# EAGLE design pi-crust14 (EAGLE 6.5.0)
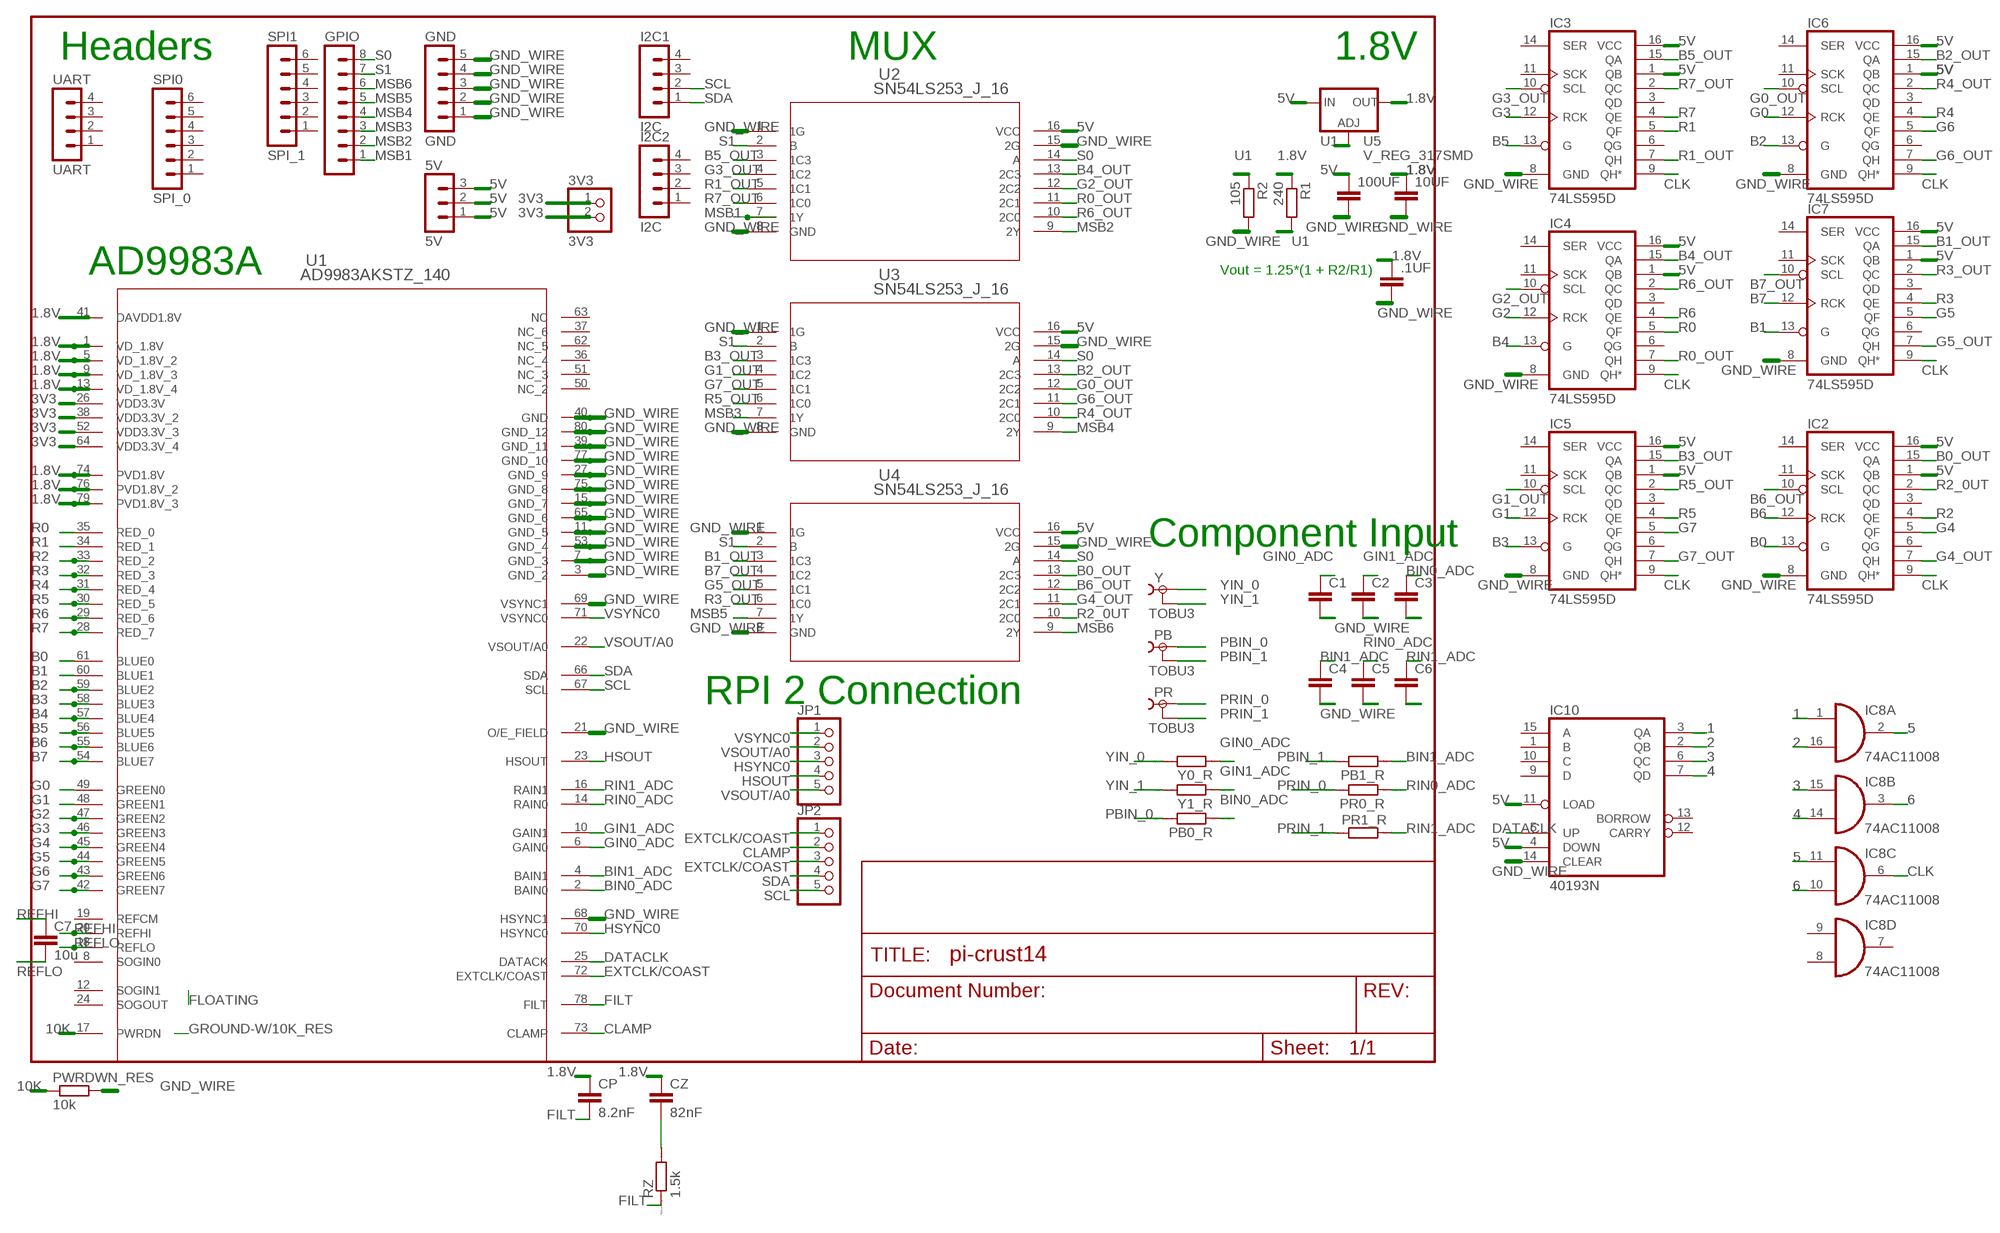
[diagram p0: schematic, sheet 1]

## Parts
3V3  3V3  PINHD-1X2  [1X02]
5V  5V  MA03-1  [MA03-1]
10UF  C2.5/5  [C2.5-5]
100UF  C2.5/5  [C2.5-5]
.1UF  C2.5/5  [C2.5-5]
C1  C2.5/5  [C2.5-5]
C2  C2.5/5  [C2.5-5]
C3  C2.5/5  [C2.5-5]
C4  C2.5/5  [C2.5-5]
C5  C2.5/5  [C2.5-5]
C6  C2.5/5  [C2.5-5]
C7  10u  C2.5/5  [C2.5-5]
CP  8.2nF  C2.5/5  [C2.5-5]
CZ  82nF  C2.5/5  [C2.5-5]
GND  GND  MA05-1  [MA05-1]
GPIO  MA08-1  [MA08-1]
I2C1  I2C  MA04-1  [MA04-1]
I2C2  I2C  MA04-1  [MA04-1]
IC2  74LS595D  [SO16]
IC3  74LS595D  [SO16]
IC4  74LS595D  [SO16]
IC5  74LS595D  [SO16]
IC6  74LS595D  [SO16]
IC7  74LS595D  [SO16]
IC8  74AC11008  [DIL16]
IC10  40193N  [DIL16]
JP1  PINHD-1X5  [1X05]
JP2  PINHD-1X5  [1X05]
PB  TOBU3  [TOBU3]
PB0_R  R0204/7  [0204/7]
PB1_R  R0204/7  [0204/7]
PR  TOBU3  [TOBU3]
PR0_R  R0204/7  [0204/7]
PR1_R  R0204/7  [0204/7]
PWRDWN_RES  10k  R-EU_0204/7  [0204/7]
R1  240  R-EU_0204/7  [0204/7]
R2  105  R-EU_0204/7  [0204/7]
RZ  1.5k  R0204/7  [0204/7]
SPI0  SPI_0  MA06-1  [MA06-1]
SPI1  SPI_1  MA06-1  [MA06-1]
U1  AD9983AKSTZ_140  [ST_80_2]
U2  SN54LS253_J_16  [J16]
U3  SN54LS253_J_16  [J16]
U4  SN54LS253_J_16  [J16]
U5  V_REG_317SMD  [SOT223]
UART  UART  MA04-1  [MA04-1]
Y  TOBU3  [TOBU3]
Y0_R  R0204/7  [0204/7]
Y1_R  R0204/7  [0204/7]

## Nets
1: IC8.1(A:I0) IC10.3(QA)
1.8V: 10UF.1 .1UF.1 CP.1 CZ.1 R1.1 U1.1(VD_1.8V) U1.5(VD_1.8V_2) U1.9(VD_1.8V_3) U1.13(VD_1.8V_4) U1.41(DAVDD1.8V) U1.74(PVD1.8V) U1.76(PVD1.8V_2) U1.79(PVD1.8V_3) U5.2(OUT)
2: IC8.16(A:I1) IC10.2(QB)
3: IC8.15(B:I0) IC10.6(QC)
3V3: 3V3.1 3V3.2 U1.26(VDD3.3V) U1.38(VDD3.3V_2) U1.52(VDD3.3V_3) U1.64(VDD3.3V_4)
4: IC8.14(B:I1) IC10.7(QD)
5: IC8.2(A:O) IC8.11(C:I0)
5V: 5V.1 5V.2 5V.3 100UF.1 IC2.1(QB) IC2.16(VCC) IC3.1(QB) IC3.16(VCC) IC4.1(QB) IC4.16(VCC) IC5.1(QB) IC5.16(VCC) IC6.1(QB) IC6.16(VCC) IC7.1(QB) IC7.16(VCC) IC10.4(DOWN) IC10.11(LOAD) U2.16(VCC) U3.16(VCC) U4.16(VCC) U5.3(IN)
6: IC8.3(B:O) IC8.10(C:I1)
10K: PWRDWN_RES.1 U1.17(PWRDN)
B0: IC2.13(G) U1.61(BLUE0)
B0_OUT: IC2.15(QA) U4.13(2C3)
B1: IC7.13(G) U1.60(BLUE1)
B1_OUT: IC7.15(QA) U4.3(1C3)
B2: IC6.13(G) U1.59(BLUE2)
B2_OUT: IC6.15(QA) U3.13(2C3)
B3: IC5.13(G) U1.58(BLUE3)
B3_OUT: IC5.15(QA) U3.3(1C3)
B4: IC4.13(G) U1.57(BLUE4)
B4_OUT: IC4.15(QA) U2.13(2C3)
B5: IC3.13(G) U1.56(BLUE5)
B5_OUT: IC3.15(QA) U2.3(1C3)
B6: IC2.12(RCK) U1.55(BLUE6)
B6_OUT: IC2.10(SCL) U4.12(2C2)
B7: IC7.12(RCK) U1.54(BLUE7)
B7_OUT: IC7.10(SCL) U4.4(1C2)
BIN0_ADC: C3.1 PB0_R.1 U1.2(BAIN0)
BIN1_ADC: C4.1 PB1_R.1 U1.4(BAIN1)
CLAMP: JP2.2 U1.73(CLAMP)
CLK: IC2.9(QH*) IC3.9(QH*) IC4.9(QH*) IC5.9(QH*) IC6.9(QH*) IC7.9(QH*) IC8.6(C:O)
DATACLK: IC10.5(UP) U1.25(DATACK)
EXTCLK/COAST: JP2.1 JP2.3 U1.72(EXTCLK/COAST)
FILT: CP.2 RZ.1 U1.78(FILT)
G0: IC6.12(RCK) U1.49(GREEN0)
G0_OUT: IC6.10(SCL) U3.12(2C2)
G1: IC5.12(RCK) U1.48(GREEN1)
G1_OUT: IC5.10(SCL) U3.4(1C2)
G2: IC4.12(RCK) U1.47(GREEN2)
G2_OUT: IC4.10(SCL) U2.12(2C2)
G3: IC3.12(RCK) U1.46(GREEN3)
G3_OUT: IC3.10(SCL) U2.4(1C2)
G4: IC2.5(QF) U1.45(GREEN4)
G4_OUT: IC2.7(QH) U4.11(2C1)
G5: IC7.5(QF) U1.44(GREEN5)
G5_OUT: IC7.7(QH) U4.5(1C1)
G6: IC6.5(QF) U1.43(GREEN6)
G6_OUT: IC6.7(QH) U3.11(2C1)
G7: IC5.5(QF) U1.42(GREEN7)
G7_OUT: IC5.7(QH) U3.5(1C1)
GIN0_ADC: C1.1 U1.6(GAIN0) Y0_R.1
GIN1_ADC: C2.1 U1.10(GAIN1) Y1_R.1
GND_WIRE: 10UF.2 100UF.2 .1UF.2 C1.2 C2.2 C3.2 C4.2 C5.2 C6.2 GND.1 GND.2 GND.3 GND.4 GND.5 IC2.8(GND) IC3.8(GND) IC4.8(GND) IC5.8(GND) IC6.8(GND) IC7.8(GND) IC10.14(CLEAR) PWRDWN_RES.2 R2.2 U1.3(GND_2) U1.7(GND_3) U1.11(GND_5) U1.15(GND_7) U1.21(O/E_FIELD) U1.27(GND_9) U1.39(GND_11) U1.40(GND) U1.53(GND_4) U1.65(GND_6) U1.68(HSYNC1) U1.69(VSYNC1) U1.75(GND_8) U1.77(GND_10) U1.80(GND_12) U2.1(1G) U2.8(GND) U2.15(2G) U3.1(1G) U3.8(GND) U3.15(2G) U4.1(1G) U4.8(GND) U4.15(2G)
HSOUT: JP1.4 U1.23(HSOUT)
HSYNC0: JP1.3 U1.70(HSYNC0)
MSB1: GPIO.1 U2.7(1Y)
MSB2: GPIO.2 U2.9(2Y)
MSB3: GPIO.3 U3.7(1Y)
MSB4: GPIO.4 U3.9(2Y)
MSB5: GPIO.5 U4.7(1Y)
MSB6: GPIO.6 U4.9(2Y)
N$1: CZ.2 RZ.2
PBIN_0: PB0_R.2 PB.1
PBIN_1: PB1_R.2 PB.2 PB.2@1 PB.2@2
PRIN_0: PR0_R.2 PR.1
PRIN_1: PR1_R.1 PR.2 PR.2@1 PR.2@2
R0: IC4.5(QF) U1.35(RED_0)
R0_OUT: IC4.7(QH) U2.11(2C1)
R1: IC3.5(QF) U1.34(RED_1)
R1_OUT: IC3.7(QH) U2.5(1C1)
R2: IC2.4(QE) U1.33(RED_2)
R2_0UT: IC2.2(QC) U4.10(2C0)
R3: IC7.4(QE) U1.32(RED_3)
R3_OUT: IC7.2(QC) U4.6(1C0)
R4: IC6.4(QE) U1.31(RED_4)
R4_OUT: IC6.2(QC) U3.10(2C0)
R5: IC5.4(QE) U1.30(RED_5)
R5_OUT: IC5.2(QC) U3.6(1C0)
R6: IC4.4(QE) U1.29(RED_6)
R6_OUT: IC4.2(QC) U2.10(2C0)
R7: IC3.4(QE) U1.28(RED_7)
R7_OUT: IC3.2(QC) U2.6(1C0)
REFHI: C7.1 U1.20(REFHI)
REFLO: C7.2 U1.18(REFLO)
RIN0_ADC: C5.1 PR0_R.1 U1.14(RAIN0)
RIN1_ADC: C6.1 PR1_R.2 U1.16(RAIN1)
S0: GPIO.8 U2.14(A) U3.14(A) U4.14(A)
S1: GPIO.7 U2.2(B) U3.2(B) U4.2(B)
SCL: I2C1.2 JP2.5 U1.67(SCL)
SDA: I2C1.1 JP2.4 U1.66(SDA)
U1: R1.2 R2.1 U5.1(ADJ)
VSOUT/A0: JP1.2 JP1.5 U1.22(VSOUT/A0)
VSYNC0: JP1.1 U1.71(VSYNC0)
YIN_0: Y0_R.2 Y.1
YIN_1: Y1_R.2 Y.2 Y.2@1 Y.2@2
Unconnected: I2C1.3 I2C1.4 I2C2.1 I2C2.2 I2C2.3 I2C2.4 IC2.3(QD) IC2.6(QG) IC2.11(SCK) IC2.14(SER) IC3.3(QD) IC3.6(QG) IC3.11(SCK) IC3.14(SER) IC4.3(QD) IC4.6(QG) IC4.11(SCK) IC4.14(SER) IC5.3(QD) IC5.6(QG) IC5.11(SCK) IC5.14(SER) IC6.3(QD) IC6.6(QG) IC6.11(SCK) IC6.14(SER) IC7.3(QD) IC7.6(QG) IC7.11(SCK) IC7.14(SER) IC8.7(D:O) IC8.8(D:I1) IC8.9(D:I0) IC10.1(B) IC10.9(D) IC10.10(C) IC10.12(CARRY) IC10.13(BORROW) IC10.15(A) SPI0.1 SPI0.2 SPI0.3 SPI0.4 SPI0.5 SPI0.6 SPI1.1 SPI1.2 SPI1.3 SPI1.4 SPI1.5 SPI1.6 U1.8(SOGIN0) U1.12(SOGIN1) U1.19(REFCM) U1.24(SOGOUT) U1.36(NC_4) U1.37(NC_6) U1.50(NC_2) U1.51(NC_3) U1.62(NC_5) U1.63(NC) UART.1 UART.2 UART.3 UART.4

## Notes on the sheet
- Headers | MUX | 1.8V
- AD9983A | Vout = 1.25*(1 + R2/R1)
- Component Input
- RPI 2 Connection

## Power pins joined to a net without a drawn wire
GND: IC8.4(P:GND) IC8.5(P:GND)
VCC: IC8.12(P:VCC) IC8.13(P:VCC)
VDD: IC10.16(VDD)
VSS: IC10.8(VSS)

## Library data of the parts
3V3 = pinhead:PINHD-1X2: PIN HEADER
5V = con-lstb:MA03-1: PIN HEADER; OC_FARNELL: unknown; OC_NEWARK: unknown
10UF 100UF .1UF C1-C7 CP CZ = capacitor-wima:C: CAPACITOR naming: grid - package width
GND = con-lstb:MA05-1: PIN HEADER; OC_FARNELL: unknown; OC_NEWARK: unknown
GPIO = con-lstb:MA08-1: PIN HEADER; OC_FARNELL: unknown; OC_NEWARK: unknown
I2C1 I2C2 UART = con-lstb:MA04-1: PIN HEADER; OC_FARNELL: unknown; OC_NEWARK: unknown
IC2-IC7 = SparkFun-DigitalIC:74*595: 8-bit SHIFT REGISTER, output latch; PROD_ID: IC-07875
IC8 = 74ac-logic:74AC11008: Quadruple 2-input AND
IC10 = 40xx:40193: Binary up down COUNTER
JP1 JP2 = pinhead:PINHD-1X5: PIN HEADER
PB PR Y = con-hirschmann:TOBU3: Female Cinch CONNECTOR ( RCA Jack ); MF: FARNELL; MPN: TOBU 3; OC_FARNELL: 592791; OC_NEWARK: 06WX5914
PB0_R PB1_R PR0_R PR1_R RZ Y0_R Y1_R = eagle-ltspice:R: RESISTOR, European symbol; SPICEMODEL: NONE; SPICEPREFIX: R
PWRDWN_RES R1 R2 = rcl:R-EU_: RESISTOR, European symbol
SPI0 SPI1 = con-lstb:MA06-1: PIN HEADER; OC_FARNELL: unknown; OC_NEWARK: unknown
U1 = ad9983a:AD9983AKSTZ_140
U2-U4 = MUX:SN54LS253_J_16; DATASHEETURL: http://www.ti.com/lit/gpn/SN54LS253; DESCRIPTION: Dual 4-Line To 1-Line Data Selectors/Multiplexers With 3-State Outputs; FAMILY_NAME: DATA SELECTOR/MULTIPLEXER; GENERIC_PART_NUMBER: SN54LS253; INDUSTRY_STD_PKG_TYPE: CDIP; MANUFACTURER: Texas Instruments; PACKAGE_DESIGNATOR: J; PIN_COUNT: 16
U5 = SparkFun-PowerIC:V_REG_317: Voltage Regulator Standard LM317 adjustable voltage regulator. AOI (Adjust Output Input). Google 'LM317 Calculator' for easy to use app to get the two resistor values needed. 240/720 for 5V output. 240/390 for 3.3V output. Spark Fun Electronics SKU : COM-00527

## Board
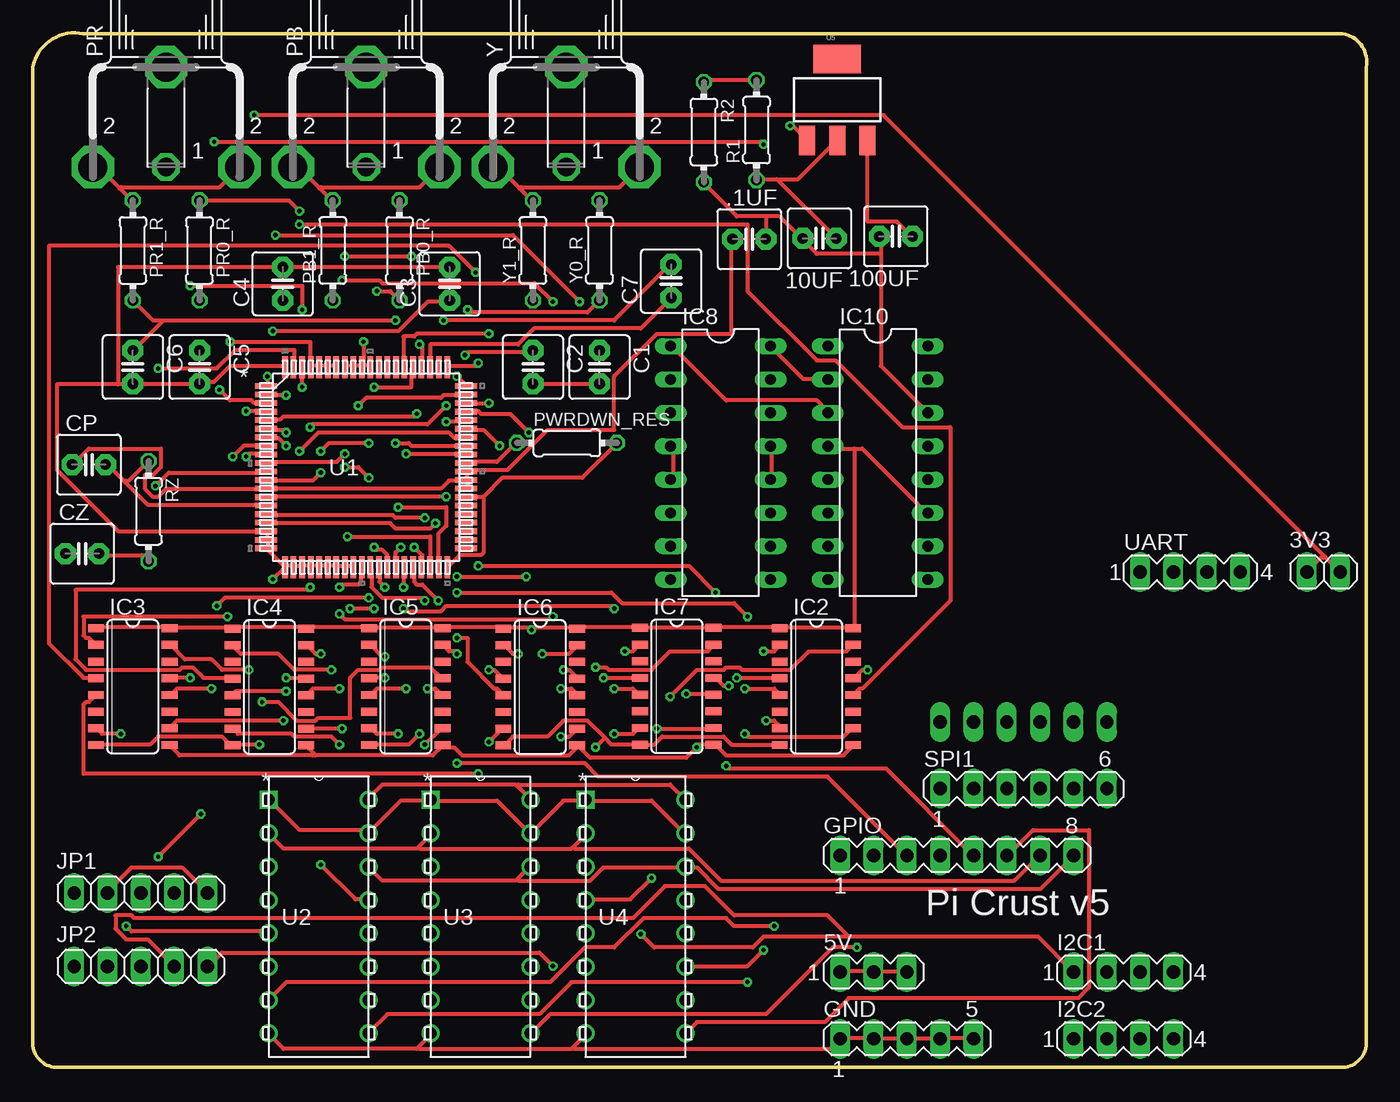
[diagram p1: board, top side]
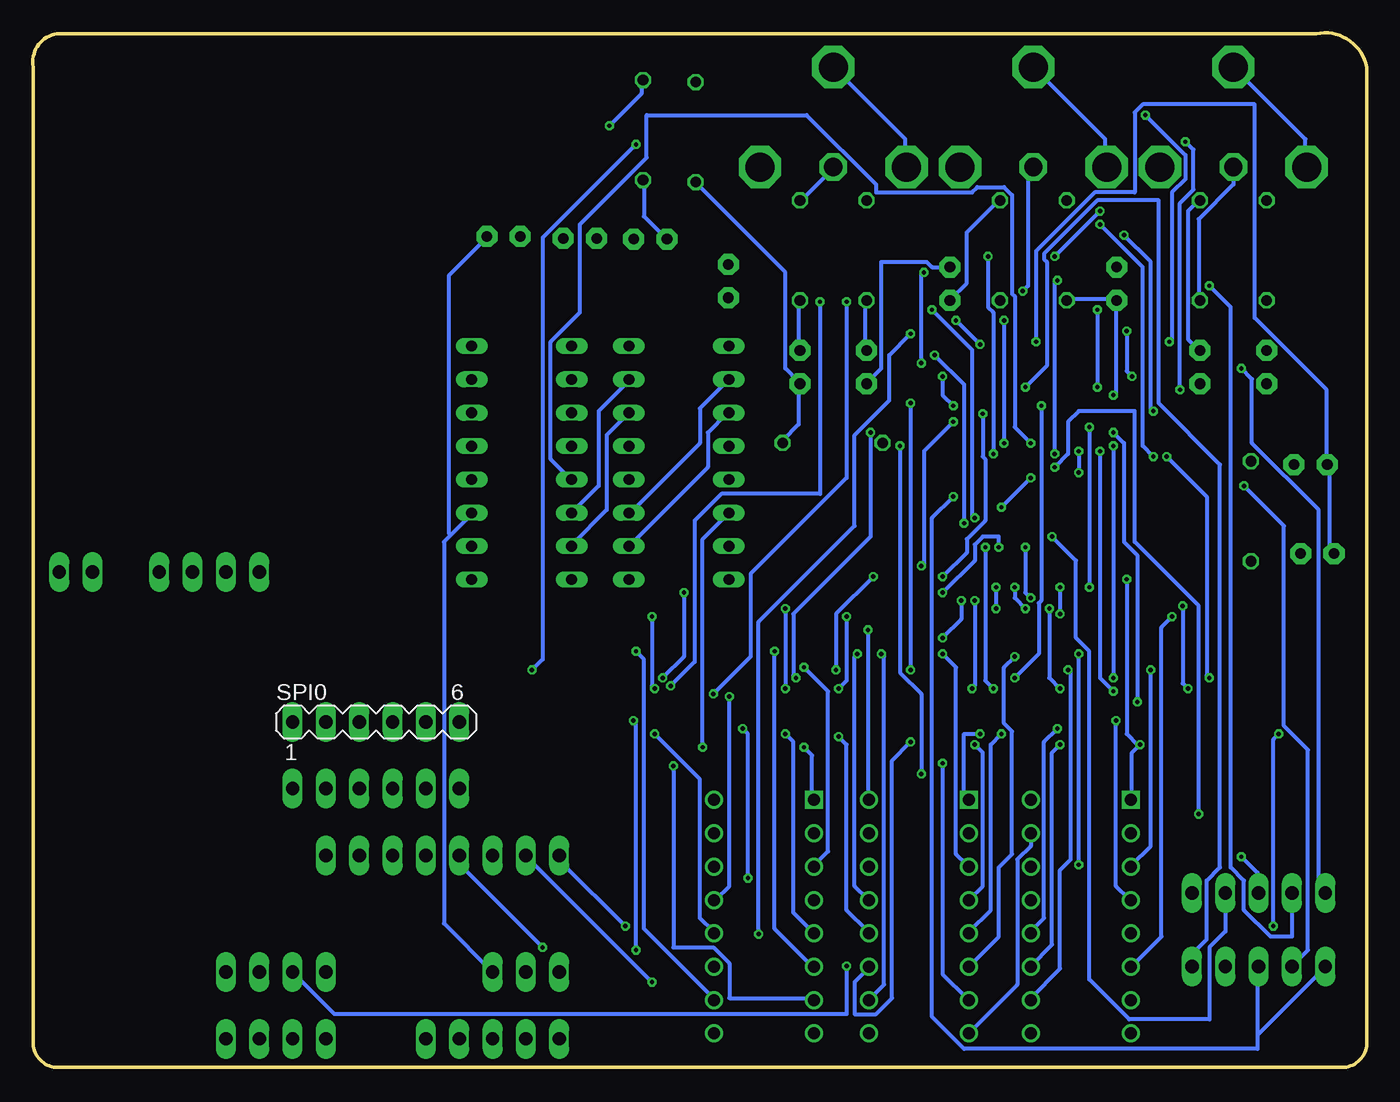
[diagram p2: board, bottom side, seen from below]

Size 101.63 x 78.79 mm. Coordinates in mm from the lower left corner, seen from the top.
Outline: 101.6,76.19 101.6,1.79 arc-90 99.69,0 1.91,0 arc-90 0,1.79 0,76.19 arc-90 3.82,78.73 99.82,78.73 arc-90 101.6,76.19
Copper layers (1*16): Top 0.0356mm / dielectric 1.5011mm / Bottom 0.0356mm
Design rules "default *": minimum track width 12mil, minimum drill 13mil, track to track 6mil, track to pad 6mil, pad to pad 6mil, via to via 6mil, smd to smd 6mil, copper to edge 15mil, drill to drill 6mil, minimum pad ring 7mil, minimum via ring 7mil, stop-mask expansion 4mil, vias tented up to drill 20mil, thermal gap 10mil

### Footprints (pad centres in the part's own frame; a part is rotated, then mirrored left to right if it is on the bottom)
1X02 = drill 1.016 long: 1 -1.27,0; 2 1.27,0
MA03-1 = drill 1.016 long: 1 -2.54,0; 2 0,0; 3 2.54,0
C2.5-5 = drill 0.813 pad 1.6 octagon: 1 -1.27,0; 2 1.27,0
MA05-1 = drill 1.016 long: 1 -5.08,0; 2 -2.54,0; 3 0,0; 4 2.54,0; 5 5.08,0
MA08-1 = drill 1.016 long: 1 -8.89,0; 2 -6.35,0; 3 -3.81,0; 4 -1.27,0; 5 1.27,0; 6 3.81,0; 7 6.35,0; 8 8.89,0
MA04-1 = drill 1.016 long: 1 -3.81,0; 2 -1.27,0; 3 1.27,0; 4 3.81,0
SO16 = smd 0.6 x 1.2: 1 -4.445,-2.8; 2 -3.175,-2.8; 3 -1.905,-2.8; 4 -0.635,-2.8; 5 0.635,-2.8; 6 1.905,-2.8; 7 3.175,-2.8; 8 4.445,-2.8; 9 4.445,2.8; 10 3.175,2.8; 11 1.905,2.8; 12 0.635,2.8; 13 -0.635,2.8; 14 -1.905,2.8; 15 -3.175,2.8; 16 -4.445,2.8
DIL16 = drill 0.813 long: 1 -8.89,-3.81; 2 -6.35,-3.81; 3 -3.81,-3.81; 4 -1.27,-3.81; 5 1.27,-3.81; 6 3.81,-3.81; 7 6.35,-3.81; 8 8.89,-3.81; 9 8.89,3.81; 10 6.35,3.81; 11 3.81,3.81; 12 1.27,3.81; 13 -1.27,3.81; 14 -3.81,3.81; 15 -6.35,3.81; 16 -8.89,3.81
1X05 = drill 1.016 long: 1 -5.08,0; 2 -2.54,0; 3 0,0; 4 2.54,0; 5 5.08,0
TOBU3 = drill 1.397 octagon: 1 0,-2.54 | drill 2.21 octagon: 2 5.588,-2.54; 2@1 -5.588,-2.54; 2@2 0,5.08
0204/7 = drill 0.813 octagon: 1 -3.81,0; 2 3.81,0
MA06-1 = drill 1.016 long: 1 -6.35,0; 2 -3.81,0; 3 -1.27,0; 4 1.27,0; 5 3.81,0; 6 6.35,0
ST_80_2 = smd 0.432 x 1.676: 1 0.33,7.62; 5 -0.33,7.62; 8 2.286,7.62; 9 -0.965,7.62; 12 1.626,7.62; 13 -1.626,7.62; 15 -6.172,-7.62; 18 4.216,7.62; 19 5.537,7.62; 20 4.877,7.62; 22 -4.877,7.62; 23 4.877,-7.62; 24 0.965,7.62; 26 -2.286,7.62; 27 -5.537,-7.62; 28 6.172,7.62; 38 -2.921,7.62; 39 -4.877,-7.62; 40 -4.216,-7.62; 42 4.216,-7.62; 43 3.581,-7.62; 44 2.921,-7.62; 45 2.286,-7.62; 46 1.626,-7.62; 47 0.965,-7.62; 48 0.33,-7.62; 49 -0.33,-7.62; 52 -3.581,7.62; 53 -3.581,-7.62; 64 -4.216,7.62; 65 -2.921,-7.62; 66 2.921,7.62; 67 3.581,7.62; 68 6.172,-7.62; 69 -6.172,7.62; 70 5.537,-7.62; 71 -5.537,7.62; 75 -2.286,-7.62; 77 -1.626,-7.62; 80 -0.965,-7.62 | smd 1.676 x 0.432: 2 -7.62,6.172; 3 -7.62,-4.877; 4 -7.62,5.537; 6 -7.62,-3.581; 7 -7.62,-5.537; 10 -7.62,-4.216; 11 -7.62,-6.172; 14 7.62,0.965; 16 7.62,1.626; 17 7.62,0.33; 21 7.62,-2.286; 25 -7.62,-0.965; 29 7.62,6.172; 30 7.62,5.537; 31 7.62,4.877; 32 7.62,4.216; 33 7.62,3.581; 34 7.62,2.921; 35 7.62,2.286; 36 7.62,-6.172; 37 7.62,-5.537; 41 -7.62,-1.626; 50 7.62,-4.877; 51 7.62,-4.216; 54 -7.62,0.33; 55 -7.62,0.965; 56 -7.62,1.626; 57 -7.62,2.286; 58 -7.62,2.921; 59 -7.62,3.581; 60 -7.62,4.216; 61 -7.62,4.877; 62 7.62,-3.581; 63 7.62,-2.921; 72 -7.62,-2.286; 73 -7.62,-0.33; 74 7.62,-1.626; 76 7.62,-0.965; 78 -7.62,-2.921; 79 7.62,-0.33
J16 = drill 0.914 square: 1 -7.62,17.78 | drill 0.914: 2 -7.62,15.24; 3 -7.62,12.7; 4 -7.62,10.16; 5 -7.62,7.62; 6 -7.62,5.08; 7 -7.62,2.54; 8 -7.62,0; 9 0,0; 10 0,2.54; 11 0,5.08; 12 0,7.62; 13 0,10.16; 14 0,12.7; 15 0,15.24; 16 0,17.78
SOT223 = smd 1.219 x 2.235: 1 -2.311,-3.099; 2 0,-3.099; 3 2.311,-3.099 | smd 3.6 x 2.2: 4 0,3.099

### Placement (x,y rotation side)
3V3  98.35,37.73 0 top
5V  64.06,7.25 0 top
10UF  59.94,63.13 180 top
100UF  65.76,63.29 180 top
.1UF  54.58,63.08 0 top
C1  43.18,53.33 270 top
C2  38.1,53.33 270 top
C3  31.75,59.68 90 top
C4  19.05,59.68 90 top
C5  12.7,53.33 270 top
C6  7.62,53.33 270 top
C7  48.64,59.88 90 top
CP  4.27,45.91 0 top
CZ  3.76,39.13 0 top
GND  66.6,2.17 0 top
GPIO  70.41,16.14 0 top
I2C1  83.11,7.25 0 top
I2C2  83.11,2.17 0 top
IC2  59.72,29 270 top
IC3  7.62,29 270 top
IC4  18.03,28.97 270 top
IC5  28.42,29 270 top
IC6  38.66,28.97 270 top
IC7  49.07,29.02 270 top
IC8  52.4,46.04 270 top
IC10  64.39,46.04 270 top
JP1  8.23,13.27 0 top
JP2  8.23,7.69 0 top
PB  25.4,71.11 0 top
PB0_R  27.94,62.22 270 top
PB1_R  22.86,62.22 90 top
PR  10.16,71.11 0 top
PR0_R  12.7,62.22 270 top
PR1_R  7.62,62.22 270 top
PWRDWN_RES  40.69,47.56 0 top
R1  55.14,71.39 90 top
R2  51.13,71.24 270 top
RZ  8.81,42.36 270 top
SPI0  75.49,26.3 0 bottom
SPI1  75.49,21.22 0 top
U1  25.4,45.71 0 top
U2  25.6,2.58 0 top
U3  37.92,2.58 0 top
U4  49.73,2.58 0 top
U5  61.29,73.7 0 top
UART  88.19,37.73 0 top
Y  40.64,71.11 0 top
Y0_R  43.18,62.22 90 top
Y1_R  38.1,62.22 90 top

### Tracks (layer width: path | path; a pad name or v marks a point on that pad's centre or on a via)
1
  Top 0.305: IC8.1 48.77,54.85 52.83,50.79 59.74,50.79 60.55,49.98 IC10.3
1.8V  (via drill 0.33)
  Top 0.305: 56.69,67.66 55.27,67.66 R1.1 | 56.69,67.66 58.32,67.66 61.16,70.5 U5.2 | 56.69,67.66 10UF.1 | U1.76 32.92,44.69 31.7,44.69 31.09,44.08 U1.41 10.16,44.08 9.55,43.48 9.14,43.48 8.53,44.08 8.53,45.1 9.14,45.1 9.75,45.71 9.75,47.13 4.27,47.13 3.05,45.91 CP.1 | U1.74 33.12,44.08 33.12,44.69 U1.76 | U1.76 33.12,44.9 33.12,45.3 U1.79 33.12,45.51 36.17,45.51 39.22,48.55 44.3,48.55 44.3,52.62 47.55,55.87 53.24,55.87 53.24,62.98 .1UF.1 | U1.13 23.77,53.43 24.38,53.43 U1.9 24.59,53.43 24.99,53.43 U1.5 25.2,53.43 | 25.2,53.43 25.6,53.43 U1.1 | v25.2,55.26 25.2,53.43
  Bottom 0.305: .1UF.1 53.44,63.19 55.07,64.81 55.07,67.45 R1.1 | v25.2,55.26 25.2,62.17 20.73,66.64 17.68,66.64 17.68,72.74 17.07,73.34 8.53,73.34 8.53,57.09 3.05,51.6 3.05,45.91 CP.1 2.85,45.91 2.85,39.41 2.64,39.21 CZ.1
2
  Top 0.305: IC8.16 58.73,52.42 60.55,52.42 IC10.2
3
  Bottom 0.305: IC10.6 58.52,44.29 58.52,49.98 56.29,52.21 IC8.15
3V3  (via drill 0.33)
  Top 0.305: U1.26 22.96,53.43 22.55,53.43 U1.38 22.35,53.43 21.95,53.43 U1.52 21.74,53.43 21.34,53.43 U1.64 21.13,53.43 21.13,55.26 v15.04,55.26 | v16.87,72.53 64.82,72.53 98.45,38.9 | 3V3.2 98.45,38.9 | 3V3.1 98.15,38.8 98.35,38.8 98.45,38.9
  Bottom 0.305: v15.04,55.26 14.83,55.46 14.83,66.64 13.82,67.66 13.82,69.48 v16.87,72.53
4
  Bottom 0.305: IC8.14 57.91,48.15 57.91,42.46 60.55,39.82 IC10.7
5
  Bottom 0.305: IC8.2 50.8,50.18 50.8,47.54 56.08,42.26 IC8.11
5V  (via drill 0.33)
  Top 0.305: 36.88,21.43 37.8,20.51 U3.16 | 36.88,21.43 36.78,21.53 26.62,21.53 25.6,20.51 U2.16 | U4.16 48.56,21.53 36.98,21.53 36.88,21.43 | IC3.1 4.88,33.52 10.36,33.52 IC3.16 10.57,33.52 15.04,33.52 IC4.1 15.24,33.52 20.73,33.52 IC4.16 20.93,33.52 25.6,33.52 IC5.1 25.81,33.52 31.09,33.52 IC5.16 31.29,33.52 35.76,33.52 IC6.1 35.97,33.52 38,33.52 | 38,33.52 41.45,33.52 IC6.16 41.66,33.52 46.13,33.52 IC7.1 46.33,33.52 51.82,33.52 IC7.16 52.02,33.52 56.9,33.52 IC2.1 57.1,33.52 62.38,33.52 IC2.16 62.59,33.52 62.59,47.13 | 38,33.52 v38,33.32 | U5.3 63.6,64.4 65.84,64.4 66.85,63.39 100UF.1 | 5V.1 61.57,7.31 64.01,7.31 5V.2 64.21,7.31 66.45,7.31 5V.3 | 62.59,47.13 60.76,47.13 IC10.4 | 62.59,47.13 63.2,47.13 68.07,42.26 IC10.11
  Bottom 0.305: v38,33.32 38,20.51 U3.16 | 5V.3 70.31,10.96 70.31,40.02 69.8,40.53 | 69.8,40.53 68.28,42.05 IC10.11 | 100UF.1 67.06,63.19 69.9,60.34 69.9,40.63 69.8,40.53
6
  Bottom 0.305: IC8.10 50.19,45.71 50.19,48.35 48.77,49.77 IC8.3
10K
  Top 0.305: U1.17 33.12,46.12 35.36,46.12 36.78,47.54 PWRDWN_RES.1
B0  (via drill 0.33)
  Top 0.305: v63.6,30.27 63.2,30.27 62.59,29.66 IC2.13 | v55.68,70.3 55.47,70.5 v13.82,70.5 | v14.22,51.6 15.04,50.79 16.66,50.79 16.87,50.59 U1.61
  Bottom 0.305: v63.6,30.27 62.79,31.08 62.79,63.19 v55.68,70.3 | v13.82,70.5 13.21,69.89 13.21,66.84 14.22,65.83 v14.22,51.6
B0_OUT  (via drill 0.33)
  Top 0.305: v48.56,28.23 50.6,30.27 52.63,30.27 52.83,30.47 53.85,30.47 54.05,30.27 57.71,30.27 59.13,31.69 61.98,31.69 62.38,32.1 IC2.15
  Bottom 0.305: v48.56,28.23 48.56,13.81 49.58,12.79 U4.13
B1  (via drill 0.33)
  Top 0.305: v53.03,29.05 52.63,29.05 52.02,29.66 IC7.13 | v41.66,58.31 36.58,63.39 v18.49,63.39 | v16.26,49.98 17.68,49.98 U1.60
  Bottom 0.305: v53.03,29.05 51.21,30.88 51.21,41.65 49.17,43.68 41.66,43.68 v41.66,58.31 | v18.49,63.39 16.46,61.36 16.46,50.18 v16.26,49.98
B1_OUT  (via drill 0.33)
  Top 0.305: v42.88,30.47 43.69,30.47 43.89,30.27 47.14,30.27 48.56,31.69 51.41,31.69 51.82,32.1 IC7.15
  Bottom 0.305: v42.88,30.47 41.05,28.64 41.05,16.45 42.06,15.43 U4.3
B2  (via drill 0.33)
  Top 0.305: v40.44,30.27 40.84,30.27 41.45,29.66 IC6.13 | v32.31,37.38 v37.59,37.38 | v29.26,49.77 29.06,49.57 19.1,49.57 18.9,49.37 17.88,49.37 U1.59
  Bottom 0.305: v40.44,30.27 40.44,34.53 v37.59,37.38 | v32.31,37.38 30.48,39.21 30.48,40.22 29.06,41.65 29.06,46.32 29.26,46.52 v29.26,49.77
B2_OUT  (via drill 0.33)
  Top 0.305: v38.81,31.49 40.84,31.49 41.45,32.1 IC6.15
  Bottom 0.305: v38.81,31.49 39.01,31.28 39.01,13.81 38,12.79 U3.13
B3  (via drill 0.33)
  Top 0.305: v17.48,27.83 18.69,27.83 20.12,26.41 21.54,26.41 21.74,26.61 24.18,26.61 24.18,29.66 24.79,30.27 26.42,30.27 26.62,30.47 30.28,30.47 31.09,29.66 IC5.13 | v19.3,48.35 19.1,48.55 17.88,48.55 U1.58
  Bottom 0.305: v17.48,27.83 17.48,39 18.49,40.02 18.49,47.54 v19.3,48.35
B3_OUT  (via drill 0.33)
  Top 0.305: v32.31,31.49 32.11,31.69 31.7,31.69 31.29,32.1 IC5.15
  Bottom 0.305: v32.31,31.49 31.29,30.47 31.29,16.25 30.48,15.43 U3.3
B4  (via drill 0.33)
  Top 0.305: v19.3,29.66 20.73,29.66 IC4.13 | v19.3,47.34 18.69,47.95 17.88,47.95 U1.57
  Bottom 0.305: v19.3,47.34 v19.3,29.66
B4_OUT  (via drill 0.33)
  Top 0.305: v21.95,31.49 21.54,31.49 20.93,32.1 IC4.15 | v21.95,15.43 24.59,12.79 25.6,12.79 U2.13
  Bottom 0.305: v21.95,15.43 v21.95,31.49
B5  (via drill 0.33)
  Top 0.305: v11.99,29.66 10.57,29.66 IC3.13 | v15.24,46.52 16.05,47.34 U1.56
  Bottom 0.305: v11.99,29.66 12.19,29.86 12.19,43.48 v15.24,46.52
B5_OUT  (via drill 0.33)
  Top 0.305: v16.46,30.27 14.43,30.27 13.61,31.08 11.58,31.08 10.57,32.1 IC3.15
  Bottom 0.305: v16.46,30.27 16.46,16.86 17.88,15.43 U2.3
B6  (via drill 0.33)
  Top 0.305: v20.32,64.2 54.46,64.2 54.46,59.12 59.74,53.84 61.16,53.84 66.24,48.76 69.9,48.76 69.9,35.55 63.2,28.84 62.99,28.84 62.59,28.44 IC2.12 | v16.26,46.52 16.46,46.73 17.68,46.73 U1.55
  Bottom 0.305: v20.32,64.2 17.07,60.95 17.07,47.34 v16.26,46.52
B6_OUT  (via drill 0.33)
  Top 0.305: v54.25,25.39 54.46,25.19 61.77,25.19 62.38,25.8 IC2.10
  Bottom 0.305: v54.25,25.39 50.8,21.94 50.8,11.37 49.78,10.35 U4.12
B7  (via drill 0.33)
  Top 0.305: v49.78,28.44 51.82,28.44 IC7.12 | v39.62,58.31 38.2,59.73 26.62,59.73 26.42,59.93 v23.57,59.93 | v23.77,46.73 23.16,46.12 17.88,46.12 U1.54
  Bottom 0.305: v49.78,28.44 46.94,31.28 46.94,37.58 39.62,44.9 v39.62,58.31 | v23.57,59.93 23.77,59.73 v23.77,46.73
B7_OUT  (via drill 0.33)
  Top 0.305: v47.55,25.8 51.82,25.8 IC7.10 | v47.14,14.42 45.52,12.79 42.27,12.79 U4.4
  Bottom 0.305: v47.55,25.8 47.14,25.39 v47.14,14.42
BIN0_ADC  (via drill 0.33)
  Top 0.305: v17.88,52.62 17.88,52.01 U1.2 | v18.29,56.07 27.84,56.07 30.07,58.31 31.7,58.31 C3.1
  Bottom 0.305: v17.88,52.62 18.29,53.02 v18.29,56.07 | PB0_R.1 28.04,66.03 30.48,63.59 30.48,59.73 31.7,58.51 C3.1
BIN1_ADC  (via drill 0.33)
  Top 0.305: v19.3,51.2 17.88,51.2 U1.4
  Bottom 0.305: v19.3,51.2 19.1,51.4 19.1,58.31 C4.1 19.1,58.51 22.76,58.51 PB1_R.1
CLAMP  (via drill 0.33)
  Top 0.305: v9.35,44.29 10.36,45.3 17.68,45.3 U1.73
  Bottom 0.305: v9.35,44.29 6.3,41.24 6.3,26 4.47,24.17 4.47,8.93 5.69,7.71 JP2.2
CLK  (via drill 0.33)
  Top 0.305: 21.44,23.87 21.54,23.76 30.48,23.76 31.09,24.37 IC5.9 31.29,24.37 32.11,24.37 32.72,23.76 40.84,23.76 41.45,24.37 IC6.9 41.66,24.37 42.47,23.56 49.78,23.56 v50.6,24.37 50.8,24.58 IC7.9 52.02,24.58 52.83,23.76 61.77,23.76 62.38,24.37 IC2.9 | 21.44,23.87 20.93,24.37 IC4.9 | IC3.9 10.57,24.37 11.18,23.76 21.34,23.76 21.44,23.87
  Bottom 0.305: IC8.6 50.6,40.22 v50.6,24.37
DATACLK  (via drill 0.33)
  Top 0.305: v21.95,45.3 21.34,44.69 17.88,44.69 U1.25 | v21.95,46.93 22.55,47.54 v25.6,47.54
  Bottom 0.305: v21.95,46.93 v21.95,45.3 | v25.6,47.54 26.82,48.76 26.82,58.72 27.03,58.92 27.03,66.44 27.64,67.05 29.67,67.05 30.07,66.64 37.39,66.64 37.39,67.25 42.67,72.53 54.86,72.53 54.86,69.28 59.94,64.2 59.94,57.5 62.18,55.26 62.18,46.32 60.76,44.9 IC10.5
EXTCLK/COAST  (via drill 0.33)
  Top 0.305: v31.5,43.48 17.88,43.48 U1.72
  Bottom 0.305: v31.5,43.48 33.12,41.85 33.12,3.85 30.68,1.41 8.33,1.41 8.33,2.43 | 8.33,2.43 8.33,7.51 JP2.3 | 8.33,2.43 3.25,7.51 JP2.1
FILT
  Top 0.305: 7.01,44.59 5.69,45.91 CP.2 | 7.01,44.59 8.74,42.87 17.68,42.87 U1.78 | RZ.1 8.74,46.12 7.32,44.69 7.11,44.69 7.01,44.59
G0  (via drill 0.33)
  Top 0.305: v40.23,28.84 41.05,28.84 41.45,28.44 IC6.12 | v39.62,34.33 39.42,34.13 23.77,34.13 v23.37,34.53 | v23.37,36.57 23.57,36.77 24.79,36.77 24.99,36.97 24.99,37.99 U1.49
  Bottom 0.305: v40.23,28.84 39.62,29.45 v39.62,34.33 | v23.37,36.57 v23.37,34.53
G0_OUT  (via drill 0.33)
  Top 0.305: v40.23,25.19 40.84,25.19 IC6.10
  Bottom 0.305: v40.23,25.19 39.62,24.58 39.62,11.98 38,10.35 U3.12
G1  (via drill 0.33)
  Top 0.305: v30.07,28.84 30.68,28.84 31.09,28.44 IC5.12 | v29.87,35.55 29.67,35.75 26.62,35.75 25.81,36.57 25.81,37.99 U1.48
  Bottom 0.305: v30.07,28.84 29.87,29.05 v29.87,35.55
G1_OUT  (via drill 0.33)
  Top 0.305: v29.87,24.58 31.09,25.8 IC5.10
  Bottom 0.305: v29.87,24.58 29.26,23.97 29.26,13.81 30.28,12.79 U3.4
G2  (via drill 0.33)
  Top 0.305: v23.37,28.84 21.34,28.84 20.93,28.44 IC4.12 | v26.01,34.94 v24.18,34.94 | v26.82,36.57 26.42,36.97 26.42,37.99 U1.47
  Bottom 0.305: v23.37,28.84 24.18,29.66 v24.18,34.94 | v26.01,34.94 26.82,35.75 v26.82,36.57
G2_OUT  (via drill 0.33)
  Top 0.305: v23.57,25.8 IC4.10
  Bottom 0.305: v23.57,25.8 24.59,24.78 24.59,11.37 25.6,10.35 U2.12
G3  (via drill 0.33)
  Top 0.305: v13.61,28.84 10.97,28.84 10.57,28.44 IC3.12 | v14.02,35.14 14.63,35.75 v25.6,35.75 | v26.01,39.61 26.21,39.41 26.62,39.41 27.03,39 U1.46
  Bottom 0.305: v13.61,28.84 14.02,29.25 v14.02,35.14 | v25.6,35.75 26.01,36.16 v26.01,39.61
G3_OUT  (via drill 0.33)
  Top 0.305: v19.1,26.41 10.97,26.41 10.57,26 IC3.10
  Bottom 0.305: v19.1,26.41 19.1,13.81 18.09,12.79 U2.4
G4  (via drill 0.33)
  Top 0.305: v54.25,28.84 56.49,28.84 56.9,28.44 IC2.5 | v54.46,34.33 53.44,35.35 44.91,35.35 44.09,36.16 v32.31,36.16 | v28.04,39.61 27.64,39.21 27.64,38.19 U1.45
  Bottom 0.305: v54.25,28.84 54.46,29.05 v54.46,34.33 | v32.31,36.16 29.87,38.6 29.87,39.82 29.26,40.43 28.04,40.43 v28.04,39.61
G4_OUT  (via drill 0.33)
  Top 0.305: v55.88,26.41 56.49,26.41 56.9,26 IC2.7 | v55.68,8.93 54.46,7.71 49.78,7.71 U4.11
  Bottom 0.305: v55.88,26.41 55.68,26.2 v55.68,8.93
G5  (via drill 0.33)
  Top 0.305: v44.3,28.84 45.72,28.84 46.13,28.44 IC7.5 | v44.3,34.94 44.09,35.14 31.5,35.14 31.09,34.74 28.45,34.74 v28.25,34.94 | v28.25,36.57 28.25,37.99 U1.44
  Bottom 0.305: v44.3,34.94 v44.3,28.84 | v28.25,36.57 v28.25,34.94
G5_OUT  (via drill 0.33)
  Top 0.305: v44.3,25.39 45.72,25.39 46.13,25.8 IC7.7
  Bottom 0.305: v44.3,25.39 43.69,24.78 43.69,11.78 U4.5
G6  (via drill 0.33)
  Top 0.305: v32.31,32.71 33.12,32.71 33.12,30.88 35.15,28.84 35.36,28.84 35.76,28.44 IC6.5 | v30.89,35.55 29.67,36.77 29.26,36.77 29.06,36.97 29.06,37.99 U1.43
  Bottom 0.305: v32.31,32.71 30.89,34.13 v30.89,35.55
G6_OUT  (via drill 0.33)
  Top 0.305: v34.75,24.78 35.76,25.8 IC6.7
  Bottom 0.305: v34.75,24.78 36.17,23.36 36.17,5.27 37.39,4.05 39.01,4.05 39.01,6.49 38,7.51 U3.11
G7  (via drill 0.33)
  Top 0.305: v28.45,28.84 26.21,28.84 25.81,28.44 IC5.5 | v29.06,39.61 29.67,39 29.67,38.19 U1.42
  Bottom 0.305: v28.45,28.84 29.06,29.45 v29.06,39.61
G7_OUT  (via drill 0.33)
  Top 0.305: v27.84,25.39 26.21,25.39 25.81,25.8 IC5.7
  Bottom 0.305: v27.84,25.39 28.65,24.58 28.65,11.98 30.28,10.35 U3.5
GIN0_ADC  (via drill 0.33)
  Top 0.305: v29.87,41.85 27.64,41.85 27.43,42.05 17.88,42.05 U1.6 | v33.12,57.7 33.33,57.5 42.27,57.5 Y0_R.1
  Bottom 0.305: v29.87,41.85 30.07,42.05 30.07,54.65 v33.12,57.7 | C1.1 43.28,54.65 43.28,58.31 Y0_R.1
GIN1_ADC  (via drill 0.33)
  Top 0.305: v30.68,41.44 30.28,41.04 27.64,41.04 27.23,41.44 17.88,41.44 U1.10 | v32.92,54.24 33.12,54.45 38,54.45 C2.1
  Bottom 0.305: v30.68,41.44 30.68,52.01 v32.92,54.24 | Y1_R.1 38.2,58.31 38.2,54.65 C2.1
GND
  Top 0.305: IC8.5 48.77,44.9 48.77,47.13 IC8.4
GND_WIRE  (via drill 0.33)
  Top 0.305: GND.5 71.53,2.23 69.29,2.23 GND.4 69.09,2.23 66.65,2.23 GND.3 66.45,2.23 64.21,2.23 GND.2 64.01,2.23 61.57,2.23 GND.1 60.76,1.41 41.25,1.41 41.15,1.51 | 29.36,1.51 30.28,2.43 U3.8 | 29.36,1.51 29.26,1.41 19.1,1.41 18.09,2.43 U2.8 | 41.15,1.51 41.05,1.41 29.46,1.41 29.36,1.51 | 41.15,1.51 42.06,2.43 U4.8 | 43.59,25.08 44.09,24.58 IC7.8 47.35,24.58 47.95,25.19 52.63,25.19 53.24,24.58 56.9,24.58 IC2.8 | 43.59,25.08 42.27,26.41 40.44,26.41 39.22,25.19 36.58,25.19 35.97,24.58 IC6.8 | U4.15 49.58,17.87 47.14,20.31 42.27,20.31 U4.1 42.06,20.31 40.44,20.31 38,17.87 U3.15 37.8,17.87 35.36,20.31 30.48,20.31 U3.1 30.28,20.31 28.04,20.31 25.6,17.87 U2.15 25.6,18.07 20.32,18.07 18.09,20.31 U2.1 | IC3.8 4.88,24.58 8.94,24.58 9.55,25.19 14.43,25.19 15.04,24.58 IC4.8 15.24,24.58 v17.27,24.58 | v29.46,25.39 28.65,24.58 25.81,24.58 IC5.8 | v42.88,24.37 43.59,25.08 | 55.88,64.81 56.9,64.81 58.52,63.19 10UF.2 58.73,62.98 59.74,61.97 64.62,61.97 | 55.88,64.81 53.65,64.81 51.21,67.25 R2.2 | 55.88,64.81 55.88,63.19 .1UF.2 | IC10.14 64.62,53.43 64.62,61.97 | 64.62,61.97 64.62,63.19 100UF.2 | U1.15 19.3,38.19 19.71,38.19 U1.27 19.91,38.19 20.52,38.19 | 23.77,38.19 23.16,38.19 U1.75 22.96,38.19 22.55,38.19 U1.65 22.35,38.19 21.95,38.19 U1.53 21.74,38.19 21.34,38.19 U1.40 21.13,38.19 20.52,38.19 | 23.77,38.19 24.38,38.19 U1.80 | 23.77,38.19 U1.77 | 20.52,38.19 U1.39 | U1.15 19.1,38.19 17.88,39.41 U1.11 17.88,39.61 17.88,40.02 U1.7 17.88,40.22 17.88,40.83 U1.3 6.5,40.83 1.83,45.51 1.83,52.01 6.5,52.01 | U1.69 19.1,53.43 15.04,53.43 13.82,52.21 12.8,52.21 C5.2 12.6,52.01 7.72,52.01 C6.2 7.52,52.01 6.5,52.01
  Top 0.305: C3.2 C4.2 6.5,60.95 6.5,52.01 | 34.34,43.48 34.34,39.21 34.14,39 32.51,39 31.7,38.19 U1.68 | 34.34,43.48 33.12,43.48 U1.21 | C2.2 38.2,52.01 43.08,52.01 C1.2 | 34.34,43.48 35.76,44.9 41.86,44.9 44.5,47.54 PWRDWN_RES.2 | v18.29,37.18 19.1,37.99 U1.15
  Bottom 0.305: v29.46,25.39 30.68,25.39 30.68,20.72 30.48,20.51 U3.1 | U2.1 17.88,20.51 17.88,23.97 v17.27,24.58 17.48,24.58 18.29,25.39 v18.29,37.18 | v42.88,24.37 42.27,23.76 42.27,20.51 U4.1 | U2.15 25.6,16.86 26.62,15.84 26.62,6.29 30.28,2.63 U3.8 | PWRDWN_RES.2 44.5,47.74 43.28,48.96 43.28,52.01 C1.2 43.28,52.21 44.3,53.23 44.3,60.54 51,67.25 R2.2 | C3.2 33.12,60.95 33.53,61.36 36.98,61.36 36.98,53.23 38,52.21 C2.2
HSOUT  (via drill 0.33)
  Top 0.305: U1.23 30.28,40.43 v23.98,40.43
  Bottom 0.305: v23.98,40.43 22.15,38.6 22.15,32.71 21.13,31.69 21.13,6.7 18.09,3.65 11.99,3.65 11.99,9.13 10.77,10.35 JP1.4
HSYNC0  (via drill 0.33)
  Top 0.305: v27.84,42.66 31.5,42.66 31.5,41.24 30.89,40.63 30.89,38.19 U1.70 | v25.6,44.9 24.79,45.71 v23.77,45.71 | v9.55,16.04 v12.8,19.29
  Bottom 0.305: v25.6,44.9 v27.84,42.66 | v23.77,45.71 22.76,46.73 22.76,49.16 21.95,49.98 17.68,49.98 17.68,40.02 12.8,35.14 v12.8,19.29 | v9.55,16.04 8.33,14.82 8.33,13.4 JP1.3
MSB1  (via drill 0.33)
  Top 0.305: v56.49,10.76 53.44,10.76 52.83,11.37 46.53,11.37 44.3,9.13 42.06,9.13 39.42,6.49 19.3,6.49 18.09,5.27 U2.7
  Bottom 0.305: v56.49,10.76 61.37,15.64 61.37,16.04 GPIO.1
MSB2  (via drill 0.33)
  Top 0.305: v54.46,6.49 41.05,6.49 38.61,4.05 27.03,4.05 25.6,2.63 U2.9
  Bottom 0.305: v54.46,6.49 64.01,16.04 GPIO.2
MSB3  (via drill 0.33)
  Top 0.305: v32.31,23.15 42.06,23.15 43.08,22.14 60.55,22.14 66.45,16.25 GPIO.3
  Bottom 0.305: v32.31,23.15 32.31,7.1 30.48,5.27 U3.7
MSB4  (via drill 0.33)
  Top 0.305: v62.79,9.13 60.96,9.13 55.88,4.05 39.42,4.05 38,2.63 U3.9
  Bottom 0.305: v62.79,9.13 69.09,15.43 69.09,16.04 GPIO.4
MSB5  (via drill 0.33)
  Top 0.305: v52.83,22.95 53.03,22.75 65.02,22.75 71.53,16.25 GPIO.5
  Bottom 0.305: v52.83,22.95 52.83,9.13 49.78,9.13 48.56,7.92 48.56,5.27 42.27,5.27 U4.7
MSB6
  Top 0.305: U4.9 50.6,3.44 60.35,3.44 62.18,5.27 79.65,5.27 80.47,6.09 80.47,18.07 76.2,18.07 74.37,16.25 GPIO.6
N$1
  Top 0.305: RZ.2 8.74,38.6 8.33,39 5.08,39 CZ.2
PBIN_0  (via drill 0.33)
  Top 0.305: PB0_R.2 27.23,59.12 v26.21,59.12
  Bottom 0.305: v26.21,59.12 25.81,59.53 25.81,68.06 25.4,68.47 PB.1
PBIN_1
  Top 0.305: 21.84,66.94 20.32,68.47 19.91,68.47 PB.2@1 | 21.84,66.94 22.76,66.03 PB1_R.2 | PB.2 29.46,67.05 21.95,67.05 21.84,66.94
  Bottom 0.305: PB.2@2 19.91,70.7 19.91,68.67 PB.2@1
PRIN_0
  Bottom 0.305: PR.1 10.16,67.25 12.8,64.61 12.8,58.51 PR0_R.2
PRIN_1
  Top 0.305: 6.6,66.94 5.08,68.47 4.67,68.47 PR.2@1 | 6.6,66.94 7.52,66.03 PR1_R.1 | PR.2 14.22,67.05 6.71,67.05 6.6,66.94
  Bottom 0.305: PR.2@2 4.67,70.7 4.67,68.67 PR.2@1
R0  (via drill 0.33)
  Top 0.305: v19.3,28.64 15.44,28.64 15.24,28.44 IC4.5 | v20.32,46.93 21.74,48.35 31.7,48.35 32.11,47.95 32.92,47.95 U1.35
  Bottom 0.305: v19.3,28.64 20.32,29.66 v20.32,46.93
R0_OUT  (via drill 0.33)
  Top 0.305: v23.37,24.58 22.76,25.19 19.91,25.19 19.71,25.39 15.65,25.39 IC4.7
  Bottom 0.305: v23.37,24.58 23.98,23.97 23.98,9.34 25.6,7.71 U2.11
R1  (via drill 0.33)
  Top 0.305: v33.93,22.34 3.86,22.34 3.86,27.62 4.06,27.83 4.27,27.83 4.67,28.23 IC3.5 | v35.56,47.34 34.34,48.55 33.12,48.55 U1.34
  Bottom 0.305: v33.93,22.34 33.93,28.44 35.56,30.06 v35.56,47.34
R1_OUT  (via drill 0.33)
  Top 0.305: v6.71,25.39 5.28,25.39 4.88,25.8 IC3.7 | v7.11,10.76 7.52,10.35 17.88,10.35 U2.5
  Bottom 0.305: v6.71,25.39 7.11,24.98 v7.11,10.76
R2  (via drill 0.33)
  Top 0.305: v53.65,29.66 56.9,29.66 IC2.4 | v52.02,36.16 49.99,38.19 v33.93,38.19 | v31.5,49.16 32.92,49.16 U1.33
  Bottom 0.305: v53.65,29.66 52.02,31.28 v52.02,36.16 | v33.93,38.19 33.73,38.4 33.73,46.93 v31.5,49.16
R2_0UT  (via drill 0.33)
  Top 0.305: v55.68,31.69 56.49,31.69 56.9,32.1 IC2.2
  Bottom 0.305: v55.68,31.69 55.07,31.08 55.07,10.56 49.78,5.27 U4.10
R3  (via drill 0.33)
  Top 0.305: v43.48,29.66 IC7.4 | v37.8,48.35 36.37,49.77 34.14,49.77 33.93,49.98 33.12,49.98 U1.32
  Bottom 0.305: v43.48,29.66 43.69,29.86 43.69,34.53 37.8,40.43 v37.8,48.35
R3_OUT  (via drill 0.33)
  Top 0.305: v45.11,31.69 45.72,31.69 46.13,32.1 IC7.2
  Bottom 0.305: v45.11,31.69 45.11,10.56 42.27,7.71 U4.6
R4  (via drill 0.33)
  Top 0.305: v34.75,30.27 35.15,30.27 35.76,29.66 IC6.4 | U1.31 v34.75,50.59
  Bottom 0.305: v34.75,50.59 v34.75,30.27
R4_OUT  (via drill 0.33)
  Top 0.305: v36.98,31.49 36.58,31.49 35.97,32.1 IC6.2
  Bottom 0.305: v36.98,31.49 36.78,31.28 36.78,6.29 37.8,5.27 U3.10
R5  (via drill 0.33)
  Top 0.305: v26.82,29.66 25.81,29.66 IC5.4 | v24.79,50.38 25.4,50.99 31.09,50.99 31.29,51.2 32.92,51.2 U1.30
  Bottom 0.305: v26.82,29.66 24.99,31.49 24.99,35.35 24.79,35.55 v24.79,50.38
R5_OUT  (via drill 0.33)
  Top 0.305: v26.82,31.28 26.62,31.28 25.81,32.1 IC5.2
  Bottom 0.305: v26.82,31.28 27.64,30.47 27.64,26.2 27.03,25.59 27.03,16.25 28.04,15.23 28.04,9.95 30.28,7.71 U3.6
R6  (via drill 0.33)
  Top 0.305: v21.13,36.57 20.93,36.36 3.25,36.36 3.25,31.08 4.06,30.27 11.18,30.27 11.38,30.47 12.19,30.47 13.01,29.66 15.04,29.66 IC4.4 | v21.13,48.76 21.34,48.96 30.07,48.96 v31.5,50.38 | v32.31,52.62 32.92,52.01 U1.29
  Bottom 0.305: v21.13,48.76 v21.13,36.57 | v31.5,50.38 32.31,51.2 v32.31,52.62
R6_OUT  (via drill 0.33)
  Top 0.305: v22.76,30.27 19.91,30.27 18.69,31.49 15.85,31.49 15.24,32.1 IC4.2
  Bottom 0.305: v22.76,30.27 22.55,30.06 22.55,15.84 23.37,15.03 23.37,7.51 25.6,5.27 U2.10
R7  (via drill 0.33)
  Top 0.305: v33.73,60.54 31.7,62.58 1.22,62.58 1.22,32.3 3.86,29.66 4.67,29.66 IC3.4 | v33.93,53.64 33.73,53.43 31.7,53.43 U1.28
  Bottom 0.305: v33.73,60.54 33.93,60.34 v33.93,53.64
R7_OUT  (via drill 0.33)
  Top 0.305: v14.83,34.33 3.86,34.33 3.86,32.91 4.06,32.71 4.27,32.71 4.67,32.3 IC3.2
  Bottom 0.305: v14.83,34.33 15.65,33.52 15.65,9.95 17.88,7.71 U2.6
REFHI
  Top 0.305: U1.20 30.28,55.06 36.98,55.06 38.2,56.28 46.33,56.28 48.56,58.51 C7.1
REFLO  (via drill 0.33)
  Top 0.305: v29.46,55.06 29.67,55.06 29.67,53.43 U1.18 | v31.29,56.89 44.3,56.89 48.56,61.15 C7.2
  Bottom 0.305: v31.29,56.89 v29.46,55.06
RIN0_ADC  (via drill 0.33)
  Top 0.305: v28.45,46.73 32.92,46.73 U1.14 | v23.77,61.76 v28.85,61.76 | v20.32,65.22 19.51,66.03 PR0_R.1
  Bottom 0.305: v28.45,46.73 28.45,57.5 28.85,57.9 v28.85,61.76 | v20.32,65.22 v23.77,61.76 | C5.1 12.8,54.65 13.61,55.46 13.61,65.22 12.8,66.03 PR0_R.1
RIN1_ADC  (via drill 0.33)
  Top 0.305: U1.16 28.85,47.34 28.65,47.54 v27.64,47.54 | 9.96,56.89 9.14,56.89 PR1_R.2 | 9.96,56.89 v27.64,56.89 | 9.96,56.89 7.72,54.65 C6.1
  Bottom 0.305: v27.64,56.89 v27.64,47.54
S0
  Top 0.305: 36.88,14.32 37.8,15.23 U3.14 | 36.88,14.32 36.78,14.21 26.62,14.21 25.6,15.23 U2.14 | 36.88,14.32 36.98,14.21 42.47,14.21 43.48,15.23 49.58,15.23 U4.14 49.78,15.23 50.6,15.23 52.22,13.6 76.81,13.6 79.25,16.04 GPIO.8
S1
  Top 0.305: 29.36,16.75 30.28,17.67 U3.2 | 29.36,16.75 29.26,16.65 19.1,16.65 18.09,17.67 U2.2 | 41.15,16.75 41.05,16.65 29.46,16.65 29.36,16.75 | 41.15,16.75 42.06,17.67 U4.2 | GPIO.7 76.61,16.04 74.78,14.21 52.43,14.21 49.99,16.65 41.25,16.65 41.15,16.75
SCL  (via drill 0.33)
  Top 0.305: v26.01,51.81 28.85,51.81 28.85,53.23 U1.67 | v39.62,7.71 38.61,8.73 14.43,8.73 13.41,7.71 JP2.5
  Bottom 0.305: v26.01,51.81 24.38,53.43 24.38,61.36 24.59,61.56 24.59,61.97 20.52,66.03 15.85,66.03 15.85,50.59 11.18,45.91 11.18,15.23 12.19,14.21 12.19,9.74 13.21,8.73 13.21,7.71 JP2.5 | I2C1.2 78.64,4.05 39.62,4.05 v39.62,7.71
SDA  (via drill 0.33)
  Top 0.305: v34.75,55.87 29.26,55.87 29.06,55.67 28.25,55.67 28.25,53.43 U1.66 | v46.33,10.15 47.35,9.13 54.86,9.13 55.68,9.95 62.18,9.95 | 62.18,9.95 76.61,9.95 I2C1.1 | 62.18,9.95 60.55,11.57 53.44,11.57 51.21,13.81 48.16,13.81 45.72,11.37 7.72,11.37 7.52,11.57 6.3,11.57 6.3,10.56 7.11,9.74 8.74,9.74 10.77,7.71 JP2.4
  Bottom 0.305: v34.75,55.87 36.37,54.24 36.37,50.79 39.01,48.15 39.01,41.24 46.33,33.92 v46.33,10.15
U1  (via drill 0.33)
  Top 0.305: v57.71,71.72 57.91,71.72 58.93,70.7 U5.1 | R2.1 51.21,75.17 55.07,75.17 R1.2
  Bottom 0.305: v57.71,71.72 55.27,74.16 55.27,75.17 R1.2
VCC
  Top 0.305: IC8.12 56.29,44.9 56.29,47.13 IC8.13
VSOUT/A0  (via drill 0.33)
  Top 0.305: v20.52,51.81 U1.22 | v20.52,57.7 20.52,59.53 v11.99,59.53 | JP1.5 13.21,13.4 11.38,15.23 7.52,15.23 5.69,13.4 JP1.2
  Bottom 0.305: v20.52,57.7 v20.52,51.81 | v11.99,59.53 10.36,57.9 10.36,15.23 9.35,14.21 9.35,11.98 7.32,9.95 5.69,9.95 JP1.2
VSYNC0  (via drill 0.33)
  Top 0.305: v9.55,53.23 14.02,53.23 15.44,54.65 19.91,54.65 19.91,53.43 U1.71
  Bottom 0.305: v9.55,53.23 8.74,52.42 8.74,47.54 3.66,42.46 3.66,13.81 3.25,13.4 JP1.1
YIN_0
  Bottom 0.305: Y0_R.2 43.08,66.03 40.64,68.47 Y.1
YIN_1
  Top 0.305: 37.08,66.94 35.56,68.47 35.15,68.47 Y.2@1 | 37.08,66.94 38,66.03 Y1_R.2 | Y.2 44.7,67.05 37.19,67.05 37.08,66.94
  Bottom 0.305: Y.2@2 35.15,70.7 35.15,68.67 Y.2@1

### Text on the board
tNames: Pi Crust v5